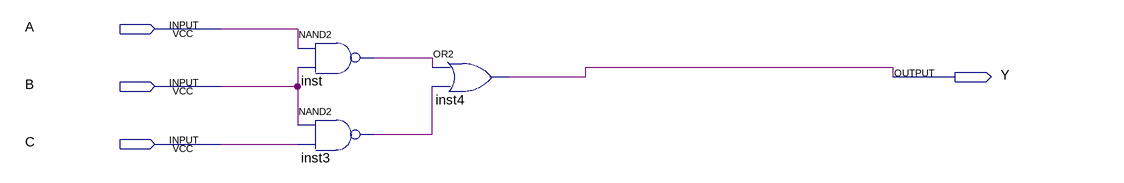
[diagram p0: schematic sheet]
// Quartus schematic detector.bdf as structural Verilog: 3 symbols, 4 pins
module detector (
  input  A,
  input  B,
  input  C,
  output Y
);

  wire inst3_out, inst_out;

  nand inst (inst_out, A, B);
  nand inst3 (inst3_out, B, C);
  or inst4 (Y, inst_out, inst3_out);
endmodule
